# Altium schematic sheet Title.SchDoc: Title Page
size Letter; Date: 2017-02-19; Revision: A; SheetNumber: 1; SheetTotal: 6; ProjectTitle: CANwheel
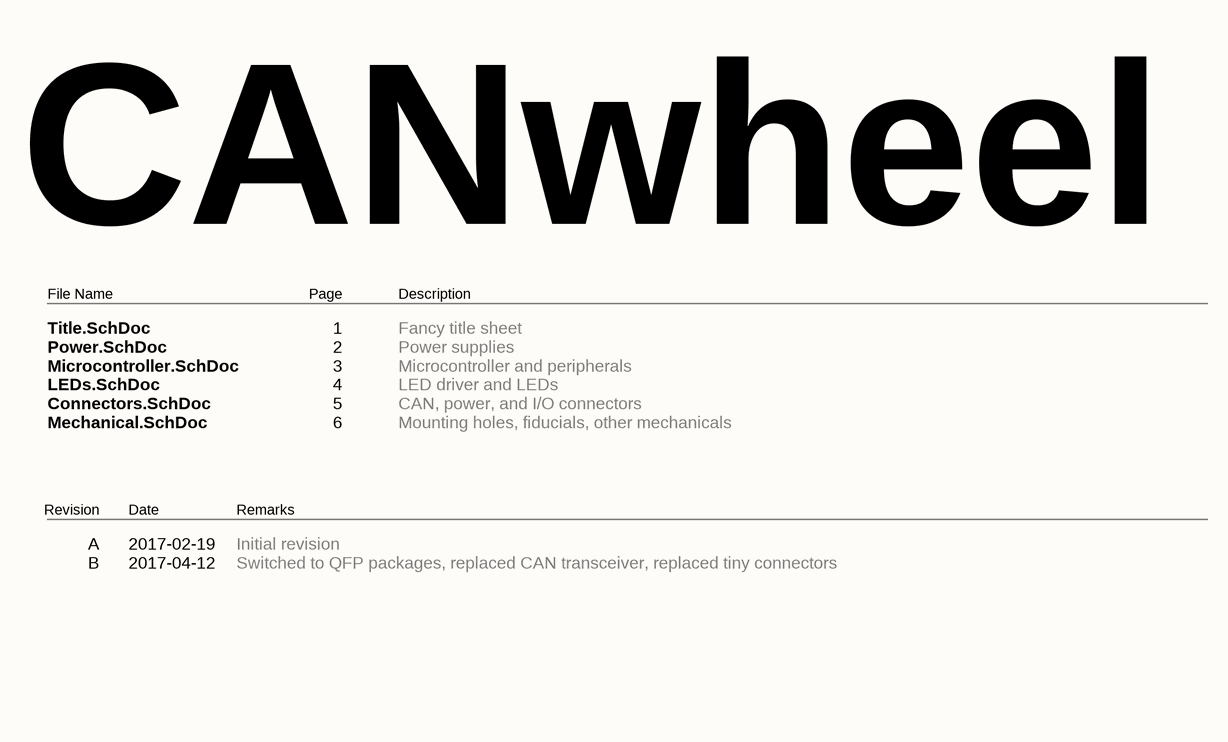
[diagram p0: Title.SchDoc]

## Notes on the sheet
- CANwheel
- File Name
- Page
- Description
- Title.SchDoc
  Power.SchDoc
  Microcontroller.SchDoc
  LEDs.SchDoc
  Connectors.SchDoc
  Mechanical.SchDoc
- 1
  2
  3
  4
  5
  6
- Fancy title sheet
  Power supplies
  Microcontroller and peripherals
  LED driver and LEDs
  CAN, power, and I/O connectors
  Mounting holes, fiducials, other mechanicals
- Revision
- Date
- Remarks
- A
  B
- 2017-02-19
  2017-04-12
- Initial revision
  Switched to QFP packages, replaced CAN transceiver, replaced tiny connectors
- Date:
- Revision:
- Sheet:
- /